# Altium schematic sheet Sheet3_Audio_Out.SchDoc: JJGEEX_Homie_POC1
size Legal; Author: Jonas Cooper; CompanyName: JJ-GEEX; DrawnBy: Jonas Cooper; Organization: Homie Secure Smarthome; Address1: -; Address2: CU Boulder ECEE; Address3: -; Address4: Capstone; DocumentNumber: 1; Revision: 1; SheetNumber: 3; SheetTotal: 4
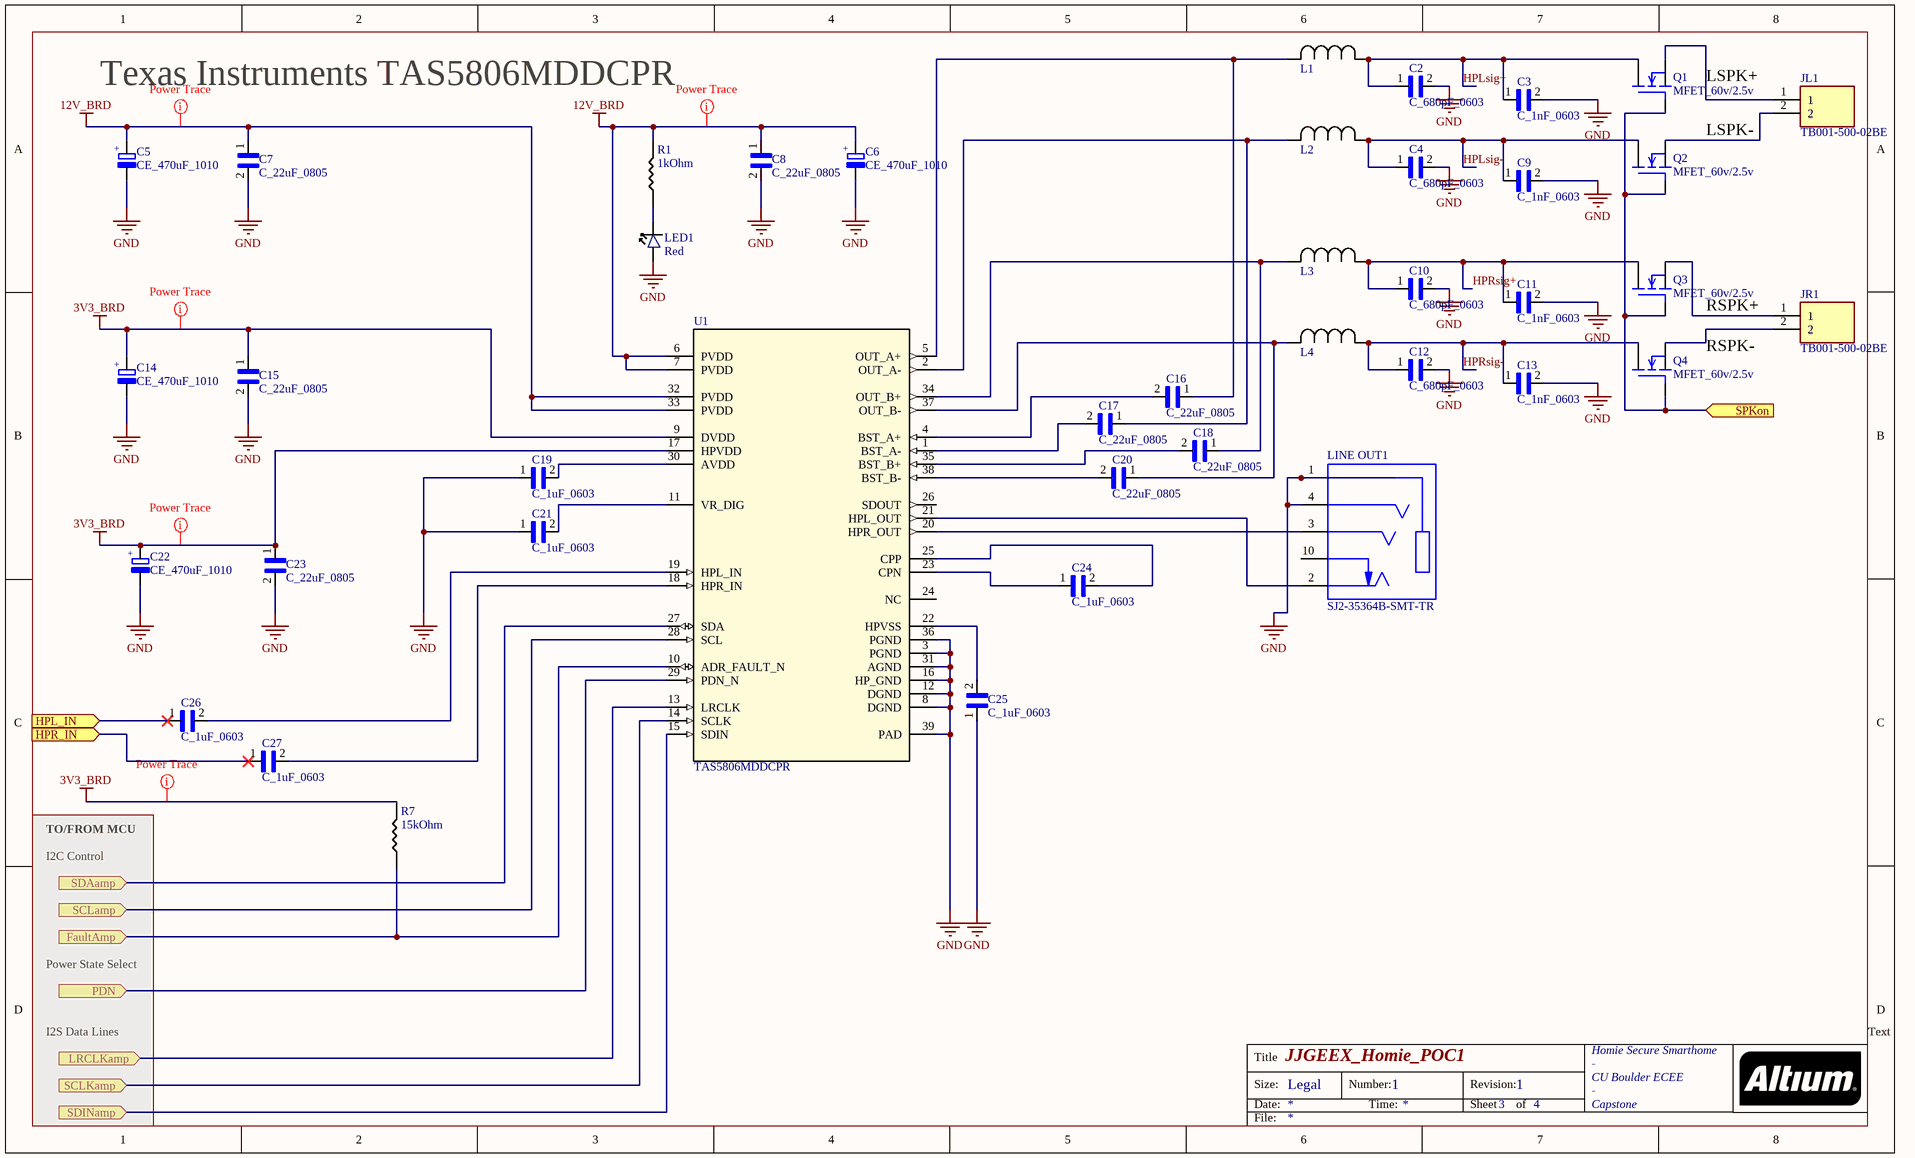
[diagram p0: Sheet3_Audio_Out.SchDoc]

## Parts
C2  C_680pF_0603  [CAPC1608X90N]
C3  C_1nF_0603  [CAPC1608X90N]
C4  C_680pF_0603  [CAPC1608X90N]
C5  CE_470uF_1010  [140CLH-1010]
C6  CE_470uF_1010  [140CLH-1010]
C7  C_22uF_0805  [CAPC2012X140N]
C8  C_22uF_0805  [CAPC2012X140N]
C9  C_1nF_0603  [CAPC1608X90N]
C10  C_680pF_0603  [CAPC1608X90N]
C11  C_1nF_0603  [CAPC1608X90N]
C12  C_680pF_0603  [CAPC1608X90N]
C13  C_1nF_0603  [CAPC1608X90N]
C14  CE_470uF_1010  [140CLH-1010]
C15  C_22uF_0805  [CAPC2012X140N]
C16  C_22uF_0805  [CAPC2012X140N]
C17  C_22uF_0805  [CAPC2012X140N]
C18  C_22uF_0805  [CAPC2012X140N]
C19  C_1uF_0603  [CAPC1608X90N]
C20  C_22uF_0805  [CAPC2012X140N]
C21  C_1uF_0603  [CAPC1608X90N]
C22  CE_470uF_1010  [140CLH-1010]
C23  C_22uF_0805  [CAPC2012X140N]
C24  C_1uF_0603  [CAPC1608X90N]
C25  C_1uF_0603  [CAPC1608X90N]
C26  C_1uF_0603  [CAPC1608X90N]
C27  C_1uF_0603  [CAPC1608X90N]
JL1  TB001-500-02BE  [CUI_TB001-500-02BE]
JR1  TB001-500-02BE  [CUI_TB001-500-02BE]
L1  SDFL1608Q4R7KTF  [L0603]  (value not drawn)
L2  SDFL1608Q4R7KTF  [L0603]  (value not drawn)
L3  SDFL1608Q4R7KTF  [L0603]  (value not drawn)
L4  SDFL1608Q4R7KTF  [L0603]  (value not drawn)
LED1  value Red  [LED0603-R-RD]  (hidden comment: KT-0603R)
LINE_OUT1  SJ2-35364B-SMT-TR  [CUI_SJ2-35364B-SMT-TR]
Q1  MFET_60v/2.5v  [SOT23]
Q2  MFET_60v/2.5v  [SOT23]
Q3  MFET_60v/2.5v  [SOT23]
Q4  MFET_60v/2.5v  [SOT23]
R1  value 1kOhm  [R0603]  (hidden comment: 1 kOhm)
R7  value 15kOhm  [R0603]  (hidden comment: 15 kOhm)
U1  TAS5806MDDCPR  [DCP0038A_N]

## Ports
FaultAmp (in), HPL_IN (in), HPR_IN (in), LRCLKamp (in), PDN (in), SCLamp (in), SCLKamp (in), SDAamp (in), SDINamp (in), SPKon (in)

## Nets
3V3_BRD: C14.POS C15.1 C22.POS C23.1 R7.2 U1.9(DVDD) U1.17(HPVDD)
12V_BRD: C5.POS C6.POS C7.1 C8.1 R1.2 U1.6(PVDD) U1.7(PVDD) U1.32(PVDD) U1.33(PVDD)
GND: C2.2 C3.2 C4.2 C5.NEG C6.NEG C7.2 C8.2 C9.2 C10.2 C11.2 C12.2 C13.2 C14.NEG C15.2 C19.1 C21.1 C22.NEG C23.2 C25.1 LED1.2 LINE_OUT1.1 LINE_OUT1.4 U1.3(PGND) U1.8(DGND) U1.12(DGND) U1.16(HP_GND) U1.31(AGND) U1.36(PGND) U1.39(PAD)
FaultAmp: R7.1 U1.10(ADR_FAULT_N) ; port FaultAmp
HPL_IN: C26.1 ; port HPL_IN
HPLsig+: C2.1 C3.1 L1.1 Q1.3(D)
HPLsig-: C4.1 C9.1 L2.1 Q2.3(D)
HPR_IN: C27.1 ; port HPR_IN
HPRsig+: C10.1 C11.1 L3.1 Q3.3(D)
HPRsig-: C12.1 C13.1 L4.1 Q4.3(D)
LRCLKamp: U1.13(LRCLK) ; port LRCLKamp
PDN: U1.29(PDN_N) ; port PDN
SCLamp: U1.28(SCL) ; port SCLamp
SCLKamp: U1.14(SCLK) ; port SCLKamp
SDAamp: U1.27(SDA) ; port SDAamp
SDINamp: U1.15(SDIN) ; port SDINamp
SPKon: Q1.1(G) Q2.1(G) Q3.1(G) Q4.1(G) ; port SPKon
NetC16_1: C16.1 L1.2 U1.5(OUT_A+)
NetC16_2: C16.2 U1.4(BST_A+)
NetC17_1: C17.1 L2.2 U1.2(OUT_A-)
NetC17_2: C17.2 U1.1(BST_A-)
NetC18_1: C18.1 L3.2 U1.34(OUT_B+)
NetC18_2: C18.2 U1.35(BST_B+)
NetC19_2: C19.2 U1.30(AVDD)
NetC20_1: C20.1 L4.2 U1.37(OUT_B-)
NetC20_2: C20.2 U1.38(BST_B-)
NetC21_2: C21.2 U1.11(VR_DIG)
NetC24_1: C24.1 U1.23(CPN)
NetC24_2: C24.2 U1.25(CPP)
NetC25_2: C25.2 U1.22(HPVSS)
NetC26_2: C26.2 U1.19(HPL_IN)
NetC27_2: C27.2 U1.18(HPR_IN)
NetJL1_1: JL1.1 Q1.2(S)
NetJL1_2: JL1.2 Q2.2(S)
NetJR1_1: JR1.1 Q3.2(S)
NetJR1_2: JR1.2 Q4.2(S)
NetLED1_1: LED1.1 R1.1
NetLINE_OUT1_2: LINE_OUT1.2 U1.21(HPL_OUT)
NetLINE_OUT1_3: LINE_OUT1.3 U1.20(HPR_OUT)

Not connected (* = marked no-connect by the designer): LINE_OUT1 10; U1 24(NC) 26(SDOUT)

## Layout directives
rule Width Constraint [Pref Width = 13mil    Min Width = 6mil    Max Width = 100mil]: 3V3_BRD, 12V_BRD

## Notes on the sheet
- Texas Instruments TAS5806MDDCPR
- LSPK+
- LSPK-
- RSPK-
- RSPK+
- TO/FROM MCU
- I2C Control
- Power State Select
- I2S Data Lines
- Text
- Title
- Size:
- Date:
- Legal
- Number:
- Time:
- Revision:
- Sheet
- of
- File:
- (in symbol CE_470uF_1010) +

## Library data of the parts
C2 C4 C10 C12 = C_680pF_0603: 680pF ±10% 50V Ceramic Capacitor X7R 0603 (1608 Metric); MP: CL10B684KO8NNNC; MF: Samsung; Price: None; SnapEDA_Link: https://www.snapeda.com/parts/CL10B102KB8NNNC/Samsung/view-part/544114/?ref=snap; Availability: Good; Package: 0603 Samsung; Value: 680pF; LCSC#: C12479
C3 C9 C11 C13 = C_1nF_0603: 1000pF ±10% 50V Ceramic Capacitor X7R 0603 (1608 Metric); MP: CL10B102KB8NNNC; MF: Samsung; Price: None; SnapEDA_Link: https://www.snapeda.com/parts/CL10B102KB8NNNC/Samsung/view-part/544114/?ref=snap; Availability: Good; Package: 0603 Samsung; Purchase-URL: https://pricing.snapeda.com/search/part/CL10B102KB8NNNC/?ref=eda; Value: 1000pF; Check_prices: https://www.snapeda.com/parts/CL10B102KB8NNNC/Samsung/view-part/544114/?ref=eda; LCSC#: c1588
C5 C6 C14 C22 = CE_470uF_1010: Aluminum Electrolytic Capacitors - SMD; MP: VZH471M1ETR-1010; MF: Lelon; Package: None; Availability: Unavailable; Value: *; SnapEDA_Link: https://www.snapeda.com/parts/VZH471M1ETR-1010/Lelon/view-part/2450679/?ref=snap; Price: None; LCSC#: C249933
C7 C8 C15-C18 C20 C23 = C_22uF_0805: 22µF 0805 ±20% 25V Ceramic Capacitor X5R 0805 (2012 Metric); MF: Samsung; MP: CL21A226MAQNNNE; SnapEDA_Link: https://www.snapeda.com/parts/CL21A226MAQNNNE/Samsung%20Electro-Mechanics/view-part/620487/?ref=snap; Check_prices: https://www.snapeda.com/parts/CL21A226MAQNNNE/Samsung%20Electro-Mechanics/view-part/620487/?ref=eda; Digi-Key_Part_Number: 1276-2908-1-ND; Value: *; Package: 0805 Samsung; Purchase-URL: https://pricing.snapeda.com/search/part/CL21A226MAQNNNE/?ref=eda; LCSC#: C45783
C19 C21 C24-C27 = C_1uF_0603: 1uF ±10% 50V Ceramic Capacitor X7R 0603 (1608 Metric); MP: CL10A105KB8NNNC; MF: Samsung; Price: None; SnapEDA_Link: https://www.snapeda.com/parts/CL10B102KB8NNNC/Samsung/view-part/544114/?ref=snap; Availability: Good; Package: 0603 Samsung; Value: 1uF; LCSC#: c15849
JL1 JR1 = TB001-500-02BE: 2~24 Poles, Screw Type, Horizontal, 5.0 Pitch, 22~12 _AWG_, Terminal Block Connector; MF: CUI Devices; MP: TB001-500-02BE; Availability: Unavailable; SnapEDA_Link: https://www.snapeda.com/parts/TB001-500-02BE/CUI%20Devices/view-part/3590292/?ref=snap; CUI_purchase_URL: https://www.cuidevices.com/product/interconnect/connectors/terminal-blocks/tb001-500-series?utm_source=snapeda.com&utm_medium=referral&utm_campaign=snapedaBOM; Package: None; Price: None; Value: *
L1-L4 = L_4.7uH: 4.7uH SDFL1608Q4R7KTF; Vendor: Sunlord; Built_By: Jonas Cooper; Manufacturer_Part_Number: SDFL1608Q4R7KTF; LCSC: C1034
LED1 = LED_RED_0603: LIGHT EMITTING DIODES (LED) RED 520~625NM 90~100MCD@20MA TOP VIEW 0603 ROHS; MFR: Hubei KENTO Elec; MFR#: KT-0603R; LCSC#: C2286
LINE_OUT1 = SJ2-35364B-SMT-TR: 3.5 mm, Stereo, Right Angle, Surface Mount (SMT), Audio Jack Connector; MF: {'manufacturer': u'CUI'}; Package: None; Availability: Unavailable; Value: *; MP: SJ2-35364B-SMT-TR; Price: None
Q1-Q4 = MFET_60v/2.5v: N-Channel 60V 200mA _Tc_ 350mW _Tc_ Surface Mount SOT-23-3; MP: 2N7002; MF: STMicroelectronics; Price: None; Package: SOT-23-3 Vishay; Value: *; Availability: Unavailable; SnapEDA_Link: https://www.snapeda.com/parts/2N7002/STMicroelectronics/view-part/2885412/?ref=snap; LCSC#: C8545
R1 = R_1kOhm_0603: 1kOhm +-1%  0603; MFR: Uniroyal; Mfr#: 0603WAF1001T5E; LCSC#: 21190
R7 = R_15kOhm_0603: 15kOhm +-1%; MFR: Uniroyal; Mfr#: 0603WAF1502T5E; LCSC#: C22809
U1 = TAS5806MDDCPR: TI Amp/DAC; Manufacturer: Texas Instruments; PartNumber: TAS5806MDDCPR; RefDes: RefDes; Type: DEV; Value: Value; Copyright: Copyright (C) 2018 Accelerated Designs. All rights reserved